# Altium schematic sheet Component_Part1.SchDoc
size A; SheetNumber: 1; SheetTotal: 2
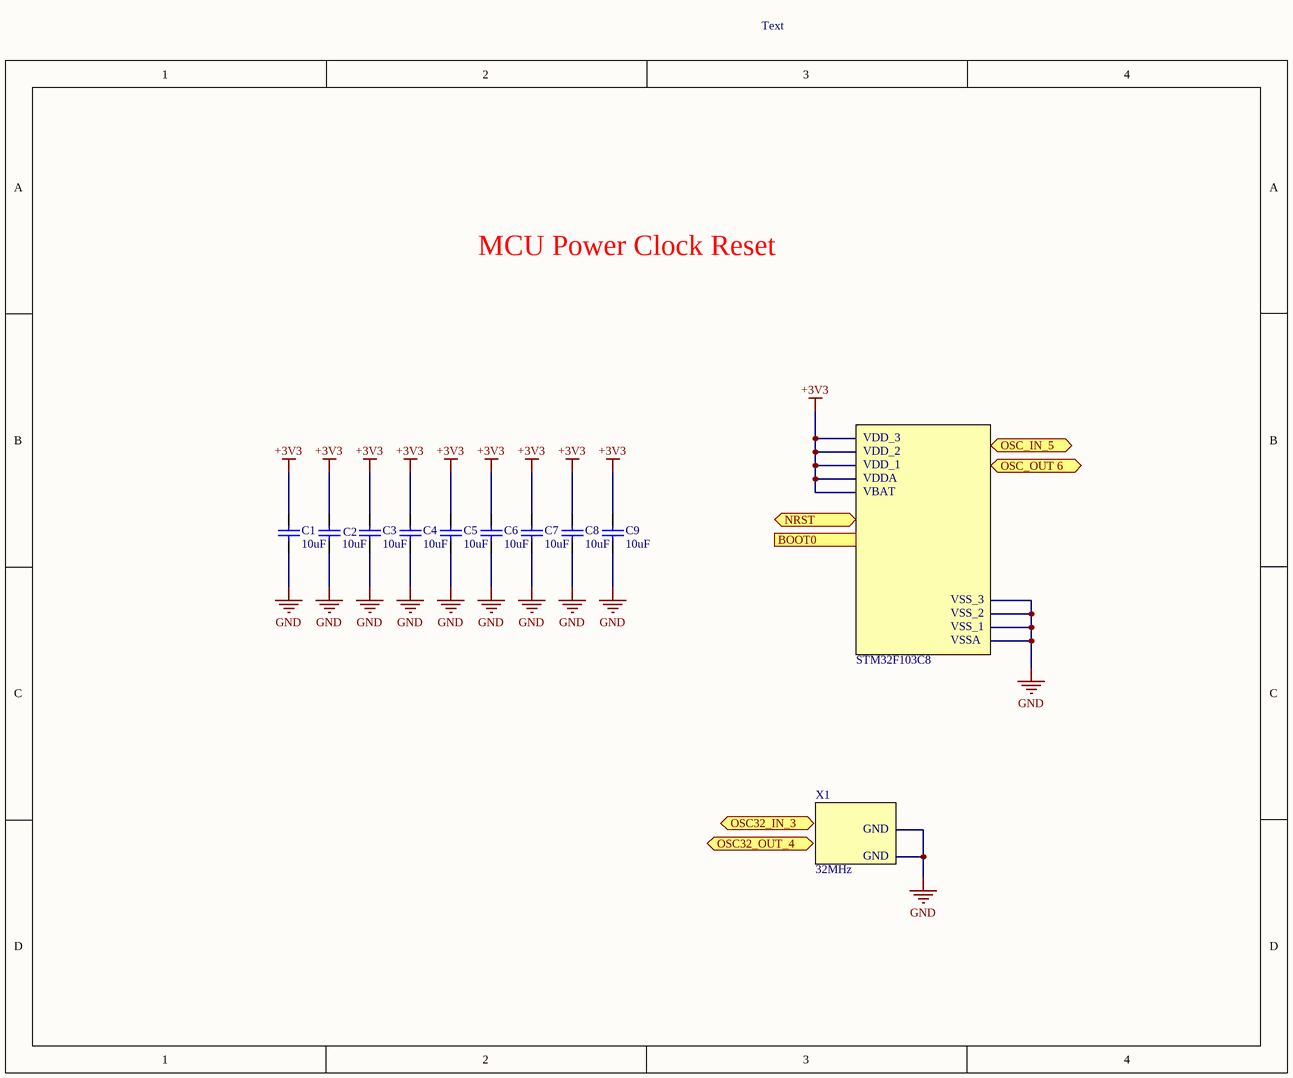
[diagram p0: Component_Part1.SchDoc]

## Parts
C1  value 10uF  (hidden comment: Capacitor)
C2  value 10uF  (hidden comment: Capacitor)
C3  value 10uF  (hidden comment: Capacitor)
C4  value 10uF  (hidden comment: Capacitor)
C5  value 10uF  (hidden comment: Capacitor)
C6  value 10uF  (hidden comment: Capacitor)
C7  value 10uF  (hidden comment: Capacitor)
C8  value 10uF  (hidden comment: Capacitor)
C9  value 10uF  (hidden comment: Capacitor)

## Ports
BOOT0 (in), NRST (bidir), OSC32_IN_3 (bidir), OSC32_OUT_4 (bidir), OSC_IN_5 (bidir), OSC_OUT 6 (bidir)

## Nets
+3V3: C1.1 C2.1 C3.1 C4.1 C5.1 C6.1 C7.1 C8.1 C9.1
GND: C1.2 C2.2 C3.2 C4.2 C5.2 C6.2 C7.2 C8.2 C9.2

## Notes on the sheet
- Text
- MCU Power Clock Reset
- VDD_3
- VDD_2
- VDD_1
- VDDA
- VBAT
- VSS_3
- VSS_2
- STM32F103C8
- VSS_1
- VSSA
- X1
- GND
- 32MHz

## Library data of the parts
C1-C9 = Capacitor: SimulationGenericComponent: True